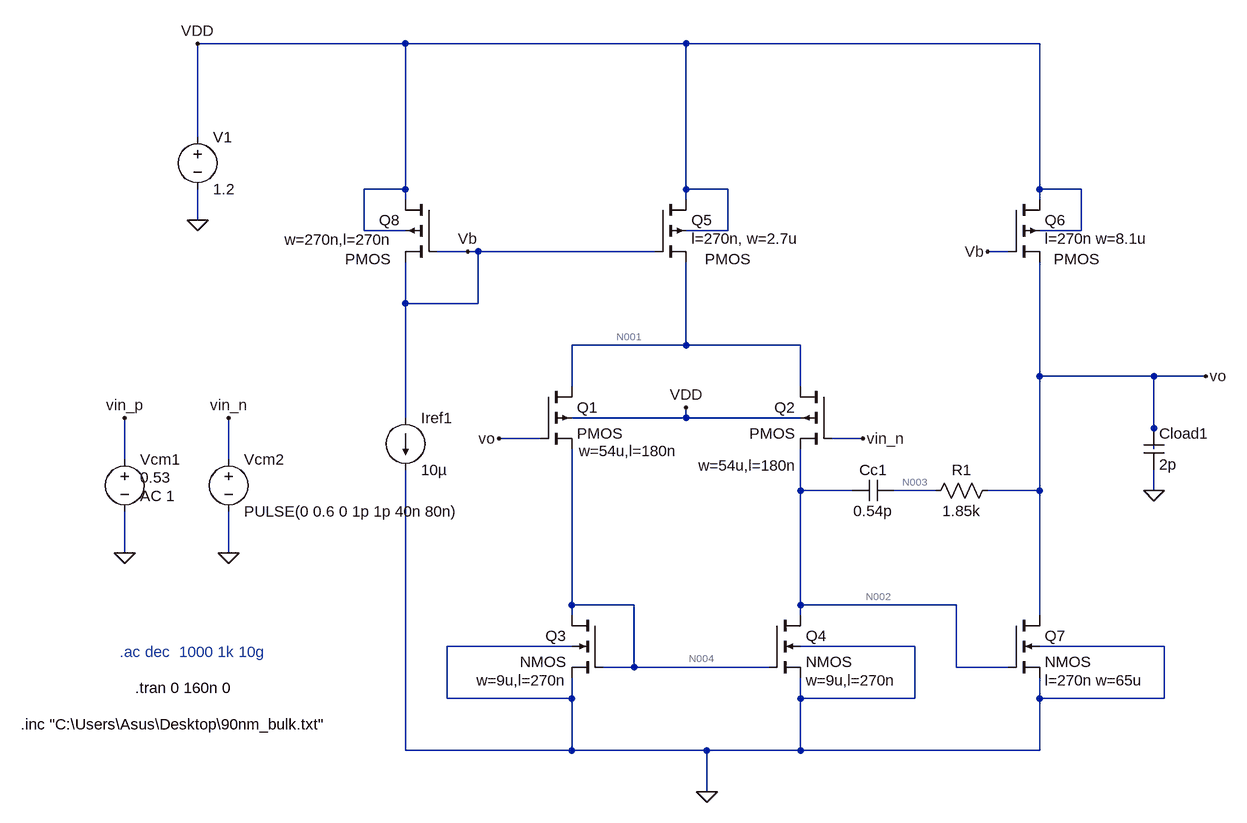
[diagram p0: schematic settling _time.asc]
settling _time.asc, the LTspice schematic file:
Version 4
SHEET 1 1592 724
WIRE -336 -448 -656 -448
WIRE 96 -448 -336 -448
WIRE 640 -448 96 -448
WIRE -656 -304 -656 -448
WIRE -336 -224 -336 -448
WIRE -336 -224 -400 -224
WIRE 96 -224 96 -448
WIRE 160 -224 96 -224
WIRE 640 -224 640 -448
WIRE 704 -224 640 -224
WIRE -336 -208 -336 -224
WIRE 96 -208 96 -224
WIRE 640 -208 640 -224
WIRE -656 -176 -656 -224
WIRE -400 -160 -400 -224
WIRE -336 -160 -400 -160
WIRE 160 -160 160 -224
WIRE 160 -160 96 -160
WIRE 704 -160 704 -224
WIRE 704 -160 640 -160
WIRE -240 -128 -288 -128
WIRE -224 -128 -240 -128
WIRE 48 -128 -224 -128
WIRE 592 -128 560 -128
WIRE -336 -48 -336 -112
WIRE -224 -48 -224 -128
WIRE -224 -48 -336 -48
WIRE 96 16 96 -112
WIRE 96 16 -80 16
WIRE 272 16 96 16
WIRE 640 64 640 -112
WIRE 816 64 640 64
WIRE 896 64 816 64
WIRE -80 80 -80 16
WIRE 272 80 272 16
WIRE -336 128 -336 -48
WIRE 96 128 96 112
WIRE 96 128 -80 128
WIRE 272 128 96 128
WIRE 816 144 816 64
WIRE -128 160 -192 160
WIRE 368 160 320 160
WIRE 816 176 816 144
WIRE -768 192 -768 128
WIRE -608 192 -608 128
WIRE 272 240 272 176
WIRE 352 240 272 240
WIRE 480 240 416 240
WIRE 640 240 640 64
WIRE 640 240 560 240
WIRE 816 240 816 208
WIRE -768 336 -768 272
WIRE -608 336 -608 272
WIRE -80 416 -80 176
WIRE 16 416 -80 416
WIRE 272 416 272 240
WIRE 512 416 272 416
WIRE -80 432 -80 416
WIRE 272 432 272 416
WIRE 640 432 640 240
WIRE -80 480 -272 480
WIRE 448 480 272 480
WIRE 832 480 640 480
WIRE 16 512 16 416
WIRE 16 512 -32 512
WIRE 224 512 16 512
WIRE 512 512 512 416
WIRE 592 512 512 512
WIRE -272 560 -272 480
WIRE -80 560 -80 528
WIRE -80 560 -272 560
WIRE 272 560 272 528
WIRE 448 560 448 480
WIRE 448 560 272 560
WIRE 640 560 640 528
WIRE 832 560 832 480
WIRE 832 560 640 560
WIRE -336 640 -336 208
WIRE -80 640 -80 560
WIRE -80 640 -336 640
WIRE 128 640 -80 640
WIRE 272 640 272 560
WIRE 272 640 128 640
WIRE 640 640 640 560
WIRE 640 640 272 640
WIRE 128 704 128 640
FLAG -192 160 vo
FLAG 368 160 vin_n
FLAG 896 64 vo
FLAG -608 336 0
FLAG -608 128 vin_n
FLAG -656 -176 0
FLAG 816 240 0
FLAG 96 112 VDD
FLAG -240 -128 Vb
FLAG 560 -128 Vb
FLAG -768 128 vin_p
FLAG -768 336 0
FLAG -656 -448 VDD
FLAG 128 704 0
DATAFLAG 640 16 "Id(Q6)"
DATAFLAG 640 208 ""
DATAFLAG 640 -320 "Id(Q6)"
DATAFLAG 96 -352 "Id(Q5)"
DATAFLAG -80 352 "Id(Q3)"
DATAFLAG 416 416 ""
DATAFLAG -416 -448 "I(V1)"
SYMBOL pmos4 -288 -208 M0
WINDOW 3 70 92 Left 2
WINDOW 123 68 62 Left 2
SYMATTR Value2 w=270n,l=270n
SYMATTR InstName Q8
SYMBOL pmos4 48 -208 R0
WINDOW 3 77 92 Left 2
WINDOW 123 56 60 Left 2
SYMATTR Value2 l=270n, w=2.7u
SYMATTR InstName Q5
SYMBOL pmos4 592 -208 R0
WINDOW 3 70 92 Left 2
WINDOW 123 56 60 Left 2
SYMATTR Value2 l=270n w=8.1u
SYMATTR InstName Q6
SYMBOL pmos4 -128 80 R0
WINDOW 123 59 99 Left 2
SYMATTR Value2 w=54u,l=180n
SYMATTR InstName Q1
SYMBOL pmos4 320 80 M0
WINDOW 123 53 121 Left 2
SYMATTR Value2 w=54u,l=180n
SYMATTR InstName Q2
SYMBOL nmos4 -32 432 M0
WINDOW 123 56 100 Left 2
SYMATTR Value2 w=9u,l=270n
SYMATTR InstName Q3
SYMBOL nmos4 224 432 R0
WINDOW 123 56 100 Left 2
SYMATTR Value2 w=9u,l=270n
SYMATTR InstName Q4
SYMBOL nmos4 592 432 R0
WINDOW 123 56 100 Left 2
SYMATTR Value2 l=270n w=65u
SYMATTR InstName Q7
SYMBOL cap 416 224 R90
WINDOW 0 0 32 VBottom 2
WINDOW 3 32 32 VTop 2
SYMATTR InstName Cc1
SYMATTR Value 0.54p
SYMBOL voltage -608 176 R0
WINDOW 123 24 124 Left 2
WINDOW 39 0 0 Left 0
SYMATTR InstName Vcm2
SYMATTR Value PULSE(0 0.6 0 1p 1p 40n 80n)
SYMBOL voltage -656 -320 R0
SYMATTR InstName V1
SYMATTR Value 1.2
SYMBOL current -336 128 R0
WINDOW 123 0 0 Left 0
WINDOW 39 0 0 Left 0
SYMATTR InstName Iref1
SYMATTR Value 10µ
SYMBOL cap 800 144 R0
SYMATTR InstName Cload1
SYMATTR Value 2p
SYMBOL voltage -768 176 R0
WINDOW 123 24 72 Left 2
WINDOW 39 0 0 Left 0
WINDOW 3 24 44 Left 2
SYMATTR Value2 AC 1
SYMATTR Value 0.53
SYMATTR InstName Vcm1
SYMBOL res 576 224 R90
WINDOW 0 0 56 VBottom 2
WINDOW 3 32 56 VTop 2
SYMATTR InstName R1
SYMATTR Value 1.85k
TEXT -928 600 Left 2 !.inc "C:\\Users\\Asus\\Desktop\\90nm_bulk.txt"
TEXT -752 544 Left 2 !.tran 0 160n 0
TEXT -776 488 Left 2 ;.ac dec  1000 1k 10g

The netlist it stands for:
* settling _time.asc
M§Q8 VDD Vb Vb VDD PMOS w=270n,l=270n
M§Q5 VDD Vb N001 VDD PMOS l=270n, w=2.7u
M§Q6 VDD Vb vo VDD PMOS l=270n w=8.1u
M§Q1 N001 vo N004 VDD PMOS w=54u,l=180n
M§Q2 N001 vin_n N002 VDD PMOS w=54u,l=180n
M§Q3 N004 N004 0 0 NMOS w=9u,l=270n
M§Q4 N002 N004 0 0 NMOS w=9u,l=270n
M§Q7 vo N002 0 0 NMOS l=270n w=65u
Cc1 N003 N002 0.54p
Vcm2 vin_n 0 PULSE(0 0.6 0 1p 1p 40n 80n)
V1 VDD 0 1.2
Iref1 Vb 0 10µ
Cload1 vo 0 2p
Vcm1 vin_p 0 0.53 AC 1
R1 vo N003 1.85k
.model NMOS NMOS
.model PMOS PMOS
.lib standard.mos
.inc "C:\Users\Asus\Desktop\90nm_bulk.txt"
.tran 0 160n 0
* .ac dec  1000 1k 10g
.backanno
.end

* Results of the author's LTspice run, read from the files saved beside the schematic
* Operating Point, zero values left out:
*   V(vdd) = 1.2 V
*   V(vb) = 335.3 mV
*   V(n001) = 500 mV
*   V(vo) = 25.13 mV
*   V(n004) = 405.5 mV
*   V(n002) = 456.2 mV
*   V(n003) = 25.13 mV
*   V(vin_p) = 530 mV
*   Id(Q8) = 10 µA
*   Is(Q8) = -10 µA
*   Id(Q5) = 102.3 µA
*   Ig(Q5) = -5.068 pA
*   Is(Q5) = -102.3 µA
*   Id(Q6) = 316.1 µA
*   Ig(Q6) = -14.81 pA
*   Ib(Q6) = 1.509 pA
*   Is(Q6) = -316.1 µA
*   Id(Q1) = 51 µA
*   Ig(Q1) = -13.92 pA
*   Ib(Q1) = 1.512 pA
*   Is(Q1) = -51 µA
*   Id(Q2) = 51.27 µA
*   Ig(Q2) = -19.4 pA
*   Ib(Q2) = 1.461 pA
*   Is(Q2) = -51.27 µA
*   Id(Q3) = 51 µA
*   Ig(Q3) = 205.2 pA
*   Is(Q3) = -51 µA
*   Id(Q4) = 51.26 µA
*   Ig(Q4) = 204.9 pA
*   Is(Q4) = -51.26 µA
*   Id(Q7) = 316.1 µA
*   Ig(Q7) = 4.951 nA
*   Is(Q7) = -316.1 µA
*   I(Iref1) = 10 µA
*   I(Vcm2) = 19.4 pA
*   I(V1) = -428.3 µA
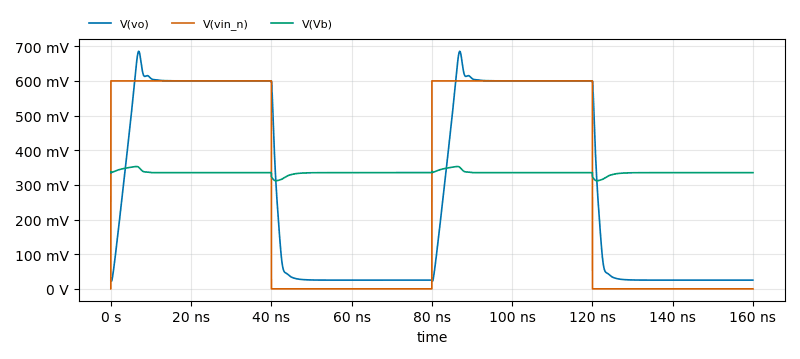
[diagram p1: Transient Analysis of settling _time.asc, plotted from the saved traces]
* Transient Analysis, 1 run:
*   V(vo): min 22 mV, max 685.6 mV, average 301 mV, rms 410 mV, last 25.13 mV
*   V(vin_n): min 0 V, max 600 mV, average 300 mV, rms 424.3 mV, last 0 V
*   V(Vb): min 311.9 mV, max 353 mV, average 335.3 mV, rms 335.4 mV, last 335.3 mV